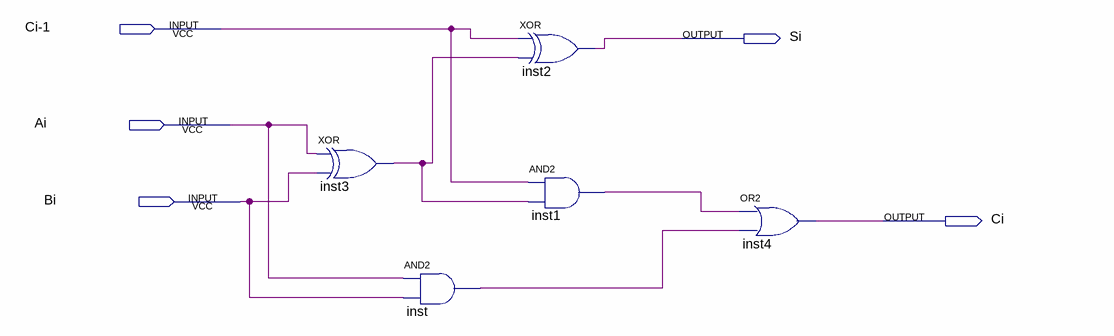
[diagram p0: schematic sheet]
// Quartus schematic ADD.bdf as structural Verilog: 5 symbols, 5 pins
module ADD (
  input  \Ci-1 ,
  input  Ai,
  input  Bi,
  output Si,
  output Ci
);

  wire inst1_out, inst3_out, inst_out;

  xor inst3 (inst3_out, Ai, Bi);
  and inst (inst_out, Ai, Bi);
  xor inst2 (Si, \Ci-1 , inst3_out);
  and inst1 (inst1_out, \Ci-1 , inst3_out);
  or inst4 (Ci, inst1_out, inst_out);
endmodule
